# Altium schematic sheet pex-MCP23S17.SchDoc: MCP23S17
size A4; DrawnBy: Dylan  Vogel; Organization: UTAT SS; Revision: 1.1
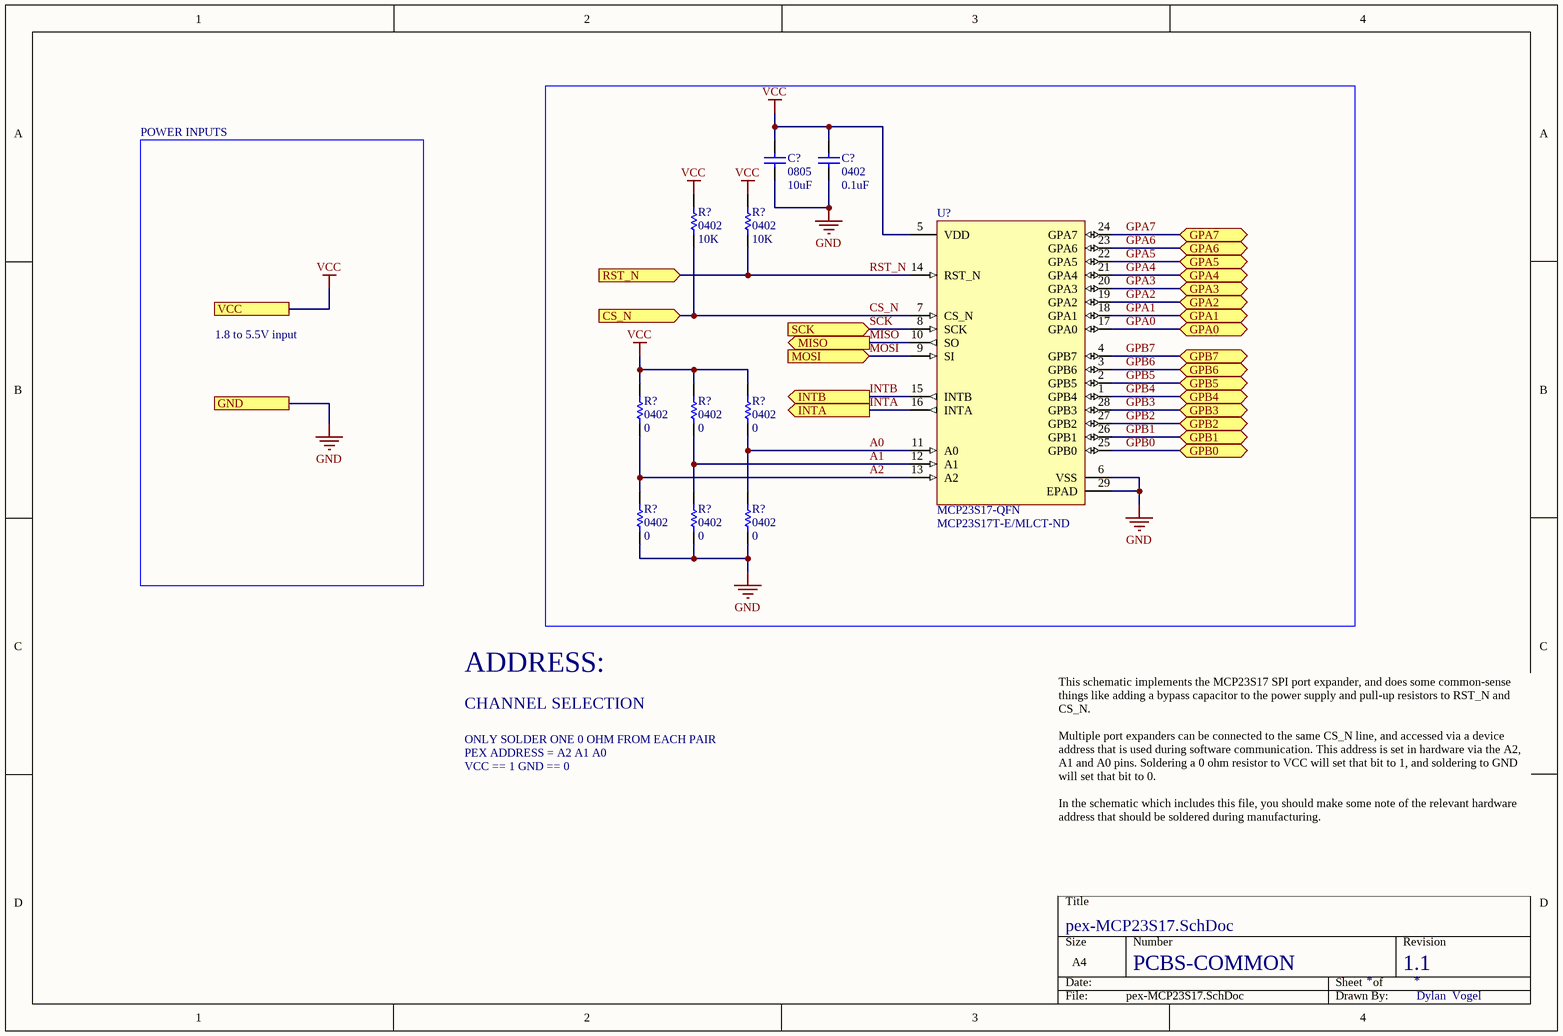
[diagram p0: pex-MCP23S17.SchDoc]

## Parts
(Parts that share a designator on the sheet are numbered #1, #2 ... from top to bottom, then left to right.)
C?#1  0805  value 10uF  [CAP0805R]
C?#2  0402  value 0.1uF  [CAP0402R]
R?#1  0402  value 10K  [RES0402R]
R?#2  0402  value 10K  [RES0402R]
R?#3  0402  value 0  [RES0402R]
R?#4  0402  value 0  [RES0402R]
R?#5  0402  value 0  [RES0402R]
R?#6  0402  value 0  [RES0402R]
R?#7  0402  value 0  [RES0402R]
R?#8  0402  value 0  [RES0402R]
U?  MCP23S17-QFN  Supplier Part Number 1: MCP23S17T-E/MLCT-ND  [QFN65P600X600X100-29]

## Ports
CS_N (in), GND, GPA0 (bidir), GPA1 (bidir), GPA2 (bidir), GPA3 (bidir), GPA4 (bidir), GPA5 (bidir), GPA6 (bidir), GPA7 (bidir), GPB0 (bidir), GPB1 (bidir), GPB2 (bidir), GPB3 (bidir), GPB4 (bidir), GPB5 (bidir), GPB6 (bidir), GPB7 (bidir), INTA (out), INTB (out), MISO (out), MOSI (in), RST_N (in), SCK (in), VCC

## Nets
GND: C?#1.1 C?#2.1 R?#6.1 R?#7.1 R?#8.1 U?.6(VSS) U?.29(EPAD) ; port GND
VCC: C?#1.2 C?#2.2 R?#1.2 R?#2.2 R?#3.2 R?#4.2 R?#5.2 U?.5(VDD) ; port VCC
A0: R?#5.1 R?#8.2 U?.11(A0)
A1: R?#4.1 R?#7.2 U?.12(A1)
A2: R?#3.1 R?#6.2 U?.13(A2)
CS_N: R?#1.1 U?.7(CS_N) ; port CS_N
GPA0: U?.17(GPA0) ; port GPA0
GPA1: U?.18(GPA1) ; port GPA1
GPA2: U?.19(GPA2) ; port GPA2
GPA3: U?.20(GPA3) ; port GPA3
GPA4: U?.21(GPA4) ; port GPA4
GPA5: U?.22(GPA5) ; port GPA5
GPA6: U?.23(GPA6) ; port GPA6
GPA7: U?.24(GPA7) ; port GPA7
GPB0: U?.25(GPB0) ; port GPB0
GPB1: U?.26(GPB1) ; port GPB1
GPB2: U?.27(GPB2) ; port GPB2
GPB3: U?.28(GPB3) ; port GPB3
GPB4: U?.1(GPB4) ; port GPB4
GPB5: U?.2(GPB5) ; port GPB5
GPB6: U?.3(GPB6) ; port GPB6
GPB7: U?.4(GPB7) ; port GPB7
INTA: U?.16(INTA) ; port INTA
INTB: U?.15(INTB) ; port INTB
MISO: U?.10(SO) ; port MISO
MOSI: U?.9(SI) ; port MOSI
RST_N: R?#2.1 U?.14(RST_N) ; port RST_N
SCK: U?.8(SCK) ; port SCK

## Notes on the sheet
- POWER INPUTS
- 1.8 to 5.5V input
- CHANNEL SELECTION
- ADDRESS:
- PEX ADDRESS = A2 A1 A0
- VCC == 1 GND == 0
- ONLY SOLDER ONE 0 OHM FROM EACH PAIR
- This schematic implements the MCP23S17 SPI port expander, and does some common-sense things like adding a bypass capacitor to the power supply and pull-up resistors to RST_N and CS_N.
  Multiple port expanders can be connected to the same CS_N line, and accessed via a device address that is used during software communication. This address is set in hardware via the A2, A1 and A0 pins. Soldering a 0 ohm resistor to VCC will set that bit to 1, and soldering to GND will set that bit to 0.
  In the schematic which includes this file, you should make some note of the relevant hardware address that should be soldered during manufacturing.
- PCBS-COMMON

## Library data of the parts
C?#1 = CAP0805: 0805 capacitor; Manufacturer: Murata; Manufacturer Part Number: GCM21BR70J106KE22K; Tolerance: 10%; Dielectric: X7R; Voltage Rating (DC): 6.3V; Supplier 1: Digi-Key; Supplier Part Number 1: 490-14361-1-ND; Stock 1: 214938; Pricing 1: 1=0.42, 10=0.29, 100=0.1742, 500=0.13064, 1000=0.11031, 2500=0.10451, 5000=0.0987 (USD); Case/Package: 0805; Min Operating Temperature: -55°C; Max Operating Temperature: 125°C; Capacitance: 10uF; Packaging: Tape and Reel; Length: 2mm; Depth: 1.25mm; Lead Free: Lead Free
C?#2 = CAP0402: 0402 capacitor; Manufacturer: Taiyo Yuden; Manufacturer Part Number: EMK105B7104KVHF; Voltage Rating: 16V; Capacitance: 100nF; Tolerance: 10%; Dielectric: X7R; Supplier 1: Digi-Key; Supplier Part Number 1: 587-3807-1-ND; Stock 1: 18196; Pricing 1: 1=0.1, 10=0.057, 100=0.0254, 500=0.01812, 1000=0.01423, 2500=0.01294, 5000=0.0119 (USD); Mount: Surface Mount; Case/Package: 0402; Weight: 2.3E-05oz; Case Code (Metric): 1005; Case Code (Imperial): 0402; Min Operating Temperature: -55°C; Max Operating Temperature: 125°C; Package Quantity: 10000; Packaging: Tape and Reel; Termination: SMD/SMT; Voltage Rating (DC): 16V; Length: 0.039inch; Height: 0.5mm; Width: 0.02inch; Thickness: 0.022inch; Ratings: AEC-Q200; Lead Free: Lead Free; Halogen Free: Halogen Free
R?#1 R?#2 = RES0402: 0402 resistor; Manufacturer: Panasonic; Manufacturer Part Number: ERJ-2RKF1002X; Resistance: 10kR; Power Rating: 100mW; Tolerance: 1%; Voltage Rating: 50V; Temperature Coefficient: 100ppm/°C; Supplier 1: Digi-Key; Supplier Part Number 1: P10.0KLCT-ND; Stock 1: 14350001; Pricing 1: 1=0.1, 10=0.045, 100=0.0183, 1000=0.00823, 2500=0.00715, 5000=0.0059 (USD); Mount: Surface Mount; Case/Package: 0402; Number of Pins: 2; Case Code (Metric): 1005; Case Code (Imperial): 0402; Contact Plating: Tin; Min Operating Temperature: -55°C; Max Operating Temperature: 155°C; Packaging: Tape and Reel; Package Quantity: 1; Composition: Thick Film; Number of Terminations: 2; Termination: SMD/SMT; Military Standard: Not; Max Power Dissipation: 100mW; Voltage Rating (DC): 50V; Features: Automotive AEC-Q200; Length: 1mm; Height: 0.35mm; Width: 0.02inch; Depth: 0.5mm; Radiation Hardening: No; REACH SVHC: No SVHC; Lead Free: Lead Free; ComponentLink1URL: http://industrial.panasonic.com/www-data/pdf/AOA0000/AOA0000CE2.pdf?src-supplier=Future+Electronics; ComponentLink1Description: http://industrial.panasonic.com/www-data/pdf/AOA0000/AOA0000CE2.pdf?src-supplier=Future+Electronics; ComponentLink2URL: http://industrial.panasonic.com/www-data/pdf/AOA0000/AOA0000CE2.pdf?src-supplier=Avnet+Europe; ComponentLink2Description: http://industrial.panasonic.com/www-data/pdf/AOA0000/AOA0000CE2.pdf?src-supplier=Avnet+Europe; ComponentLink3URL: https://industrial.panasonic.com/cdbs/www-data/pdf/RDA0000/DMA0000COL11.pdf?src-supplier=Mouser; ComponentLink3Description: https://industrial.panasonic.com/cdbs/www-data/pdf/RDA0000/DMA0000COL11.pdf?src-supplier=Mouser; ComponentLink4URL: http://www.farnell.com/datasheets/1678782.pdf?src-supplier=Element14; ComponentLink4Description: http://www.farnell.com/datasheets/1678782.pdf?src-supplier=Element14; ComponentLink5URL: http://www.farnell.com/datasheets/1911175.pdf?src-supplier=Farnell; ComponentLink5Description: http://www.farnell.com/datasheets/1911175.pdf?src-supplier=Farnell; ComponentLink6URL: http://www.jameco.com/Jameco/Products/ProdDS/1987020.pdf?src-supplier=Jameco; ComponentLink6Description: http://www.jameco.com/Jameco/Products/ProdDS/1987020.pdf?src-supplier=Jameco; ComponentLink7URL: http://industrial.panasonic.com/www-data/pdf/AOA0000/AOA0000CE2.pdf?src-supplier=Avnet; ComponentLink7Description: http://industrial.panasonic.com/www-data/pdf/AOA0000/AOA0000CE2.pdf?src-supplier=Avnet; ComponentLink8URL: http://www.alliedelec.com/m/d/623f45ff1957d936ff56d46fd1c28cac.pdf?src-supplier=Allied+Electronics; ComponentLink8Description: http://www.alliedelec.com/m/d/623f45ff1957d936ff56d46fd1c28cac.pdf?src-supplier=Allied+Electronics
R?#3-R?#8 = RES0402: 0402 resistor; Manufacturer: Panasonic; Manufacturer Part Number: ERJ-2GE0R00X; Resistance: 0mR; Power Rating: 100mW; Voltage Rating: 50V; Tolerance: 5%; Temperature Coefficient: 600ppm/°C; Supplier 1: Digi-Key; Supplier Part Number 1: P0.0JCT-ND; Stock 1: 47740000; Pricing 1: 1=0.1, 10=0.03, 25=0.0216, 50=0.0164, 100=0.0121, 250=0.00924, 500=0.0074, 1000=0.00545, 5000=0.00391 (USD); Mount: Surface Mount; Case/Package: 0402; Case Code (Metric): 1005; Case Code (Imperial): 0402; Contact Plating: Tin; Min Operating Temperature: -55°C; Max Operating Temperature: 155°C; Packaging: Tape and Reel; Package Quantity: 1; Composition: Thick Film; Number of Terminations: 2; Termination: SMD/SMT; Military Standard: Not; Max Power Dissipation: 100mW; Voltage Rating (DC): 50V; Features: Automotive AEC-Q200; Length: 1mm; Height: 0.35mm; Width: 0.02inch; Depth: 0.5mm; Radiation Hardening: No; REACH SVHC: No SVHC; Lead Free: Lead Free; ComponentLink1URL: http://industrial.panasonic.com/www-data/pdf/AOA0000/AOA0000CE1.pdf?src-supplier=Avnet; ComponentLink1Description: http://industrial.panasonic.com/www-data/pdf/AOA0000/AOA0000CE1.pdf?src-supplier=Avnet; ComponentLink2URL: http://www.alliedelec.com/m/d/51cd0790071e1666bdb9d00c57fcf960.pdf?src-supplier=Allied+Electronics; ComponentLink2Description: http://www.alliedelec.com/m/d/51cd0790071e1666bdb9d00c57fcf960.pdf?src-supplier=Allied+Electronics; ComponentLink3URL: http://industrial.panasonic.com/www-data/pdf/AOA0000/AOA0000CE1.pdf?src-supplier=Avnet+Europe; ComponentLink3Description: http://industrial.panasonic.com/www-data/pdf/AOA0000/AOA0000CE1.pdf?src-supplier=Avnet+Europe; ComponentLink4URL: http://www.farnell.com/datasheets/2059623.pdf?src-supplier=Farnell; ComponentLink4Description: http://www.farnell.com/datasheets/2059623.pdf?src-supplier=Farnell; ComponentLink5URL: http://www.farnell.com/datasheets/2059623.pdf?src-supplier=Element14; ComponentLink5Description: http://www.farnell.com/datasheets/2059623.pdf?src-supplier=Element14; ComponentLink6URL: http://www.farnell.com/datasheets/1678796.pdf?src-supplier=Element14; ComponentLink6Description: http://www.farnell.com/datasheets/1678796.pdf?src-supplier=Element14
U? = MCP23S17-QFN: 16 channel SPI port expander; Supplier 1: Digi-Key